# EAGLE board H17R10 (EAGLE 9.6.2)
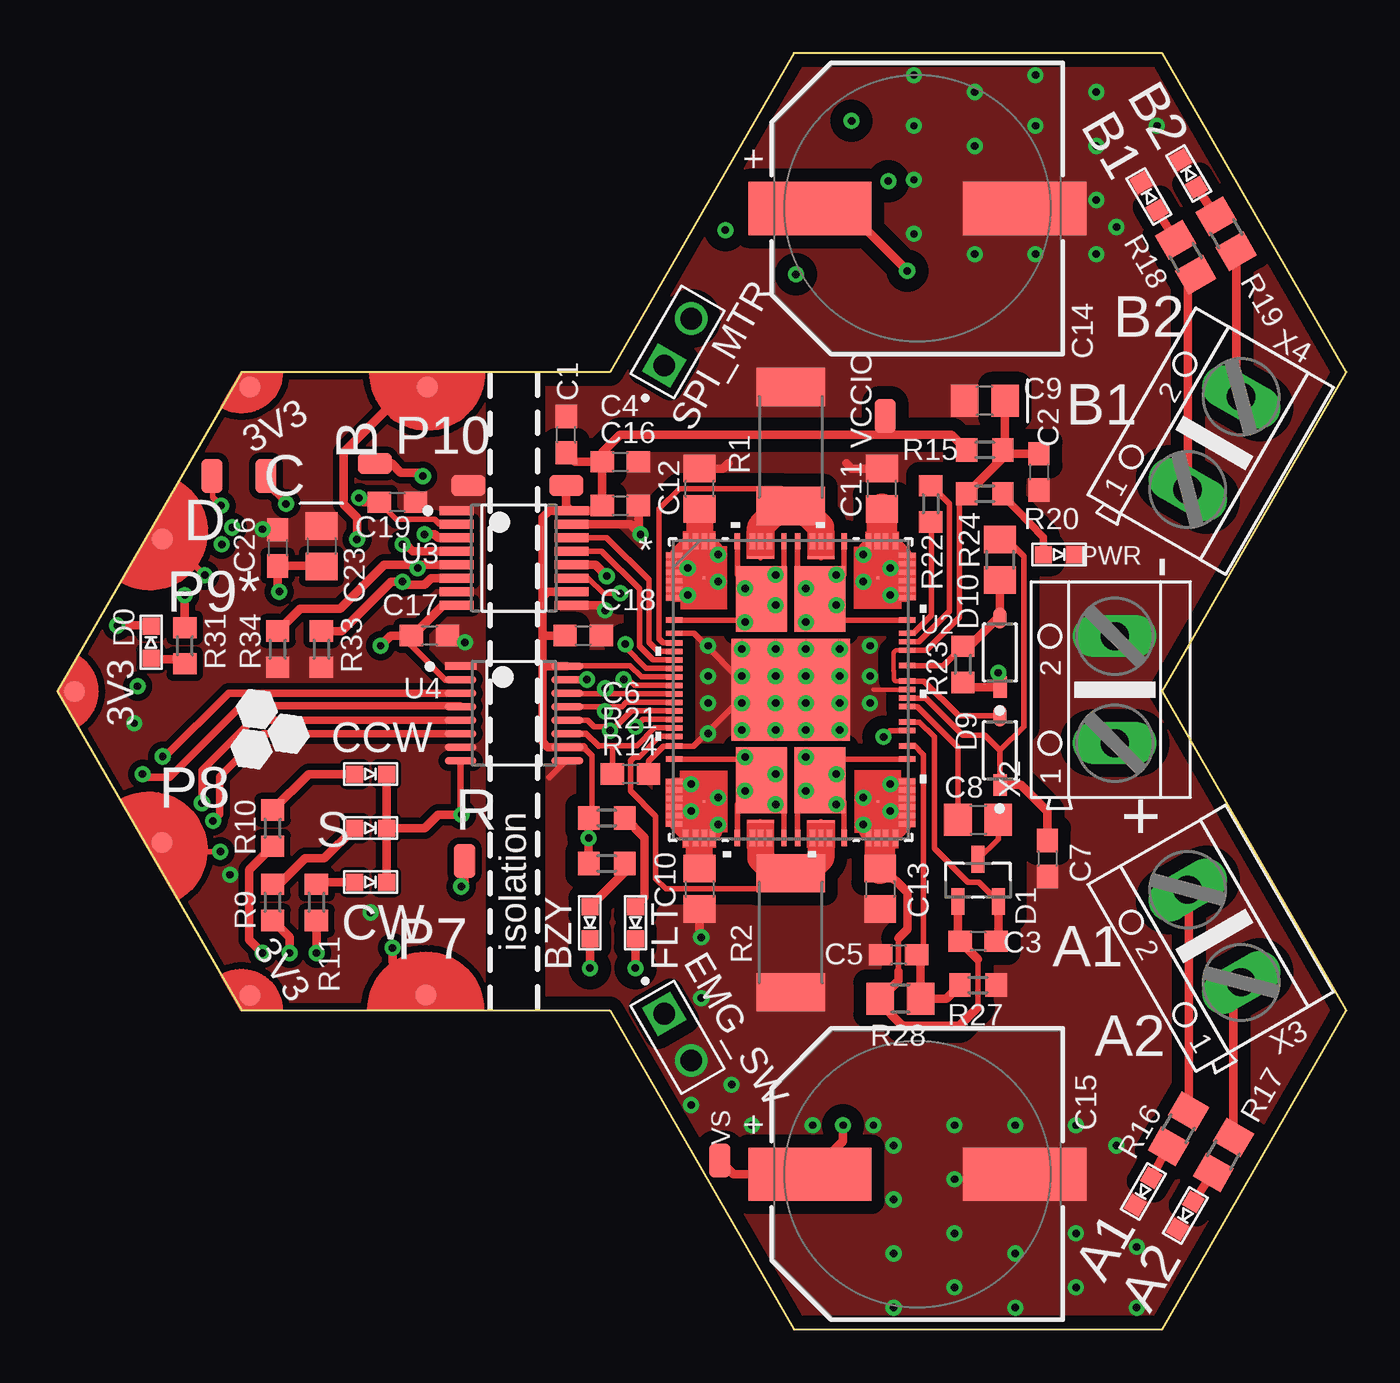
[diagram p4: board, top side]
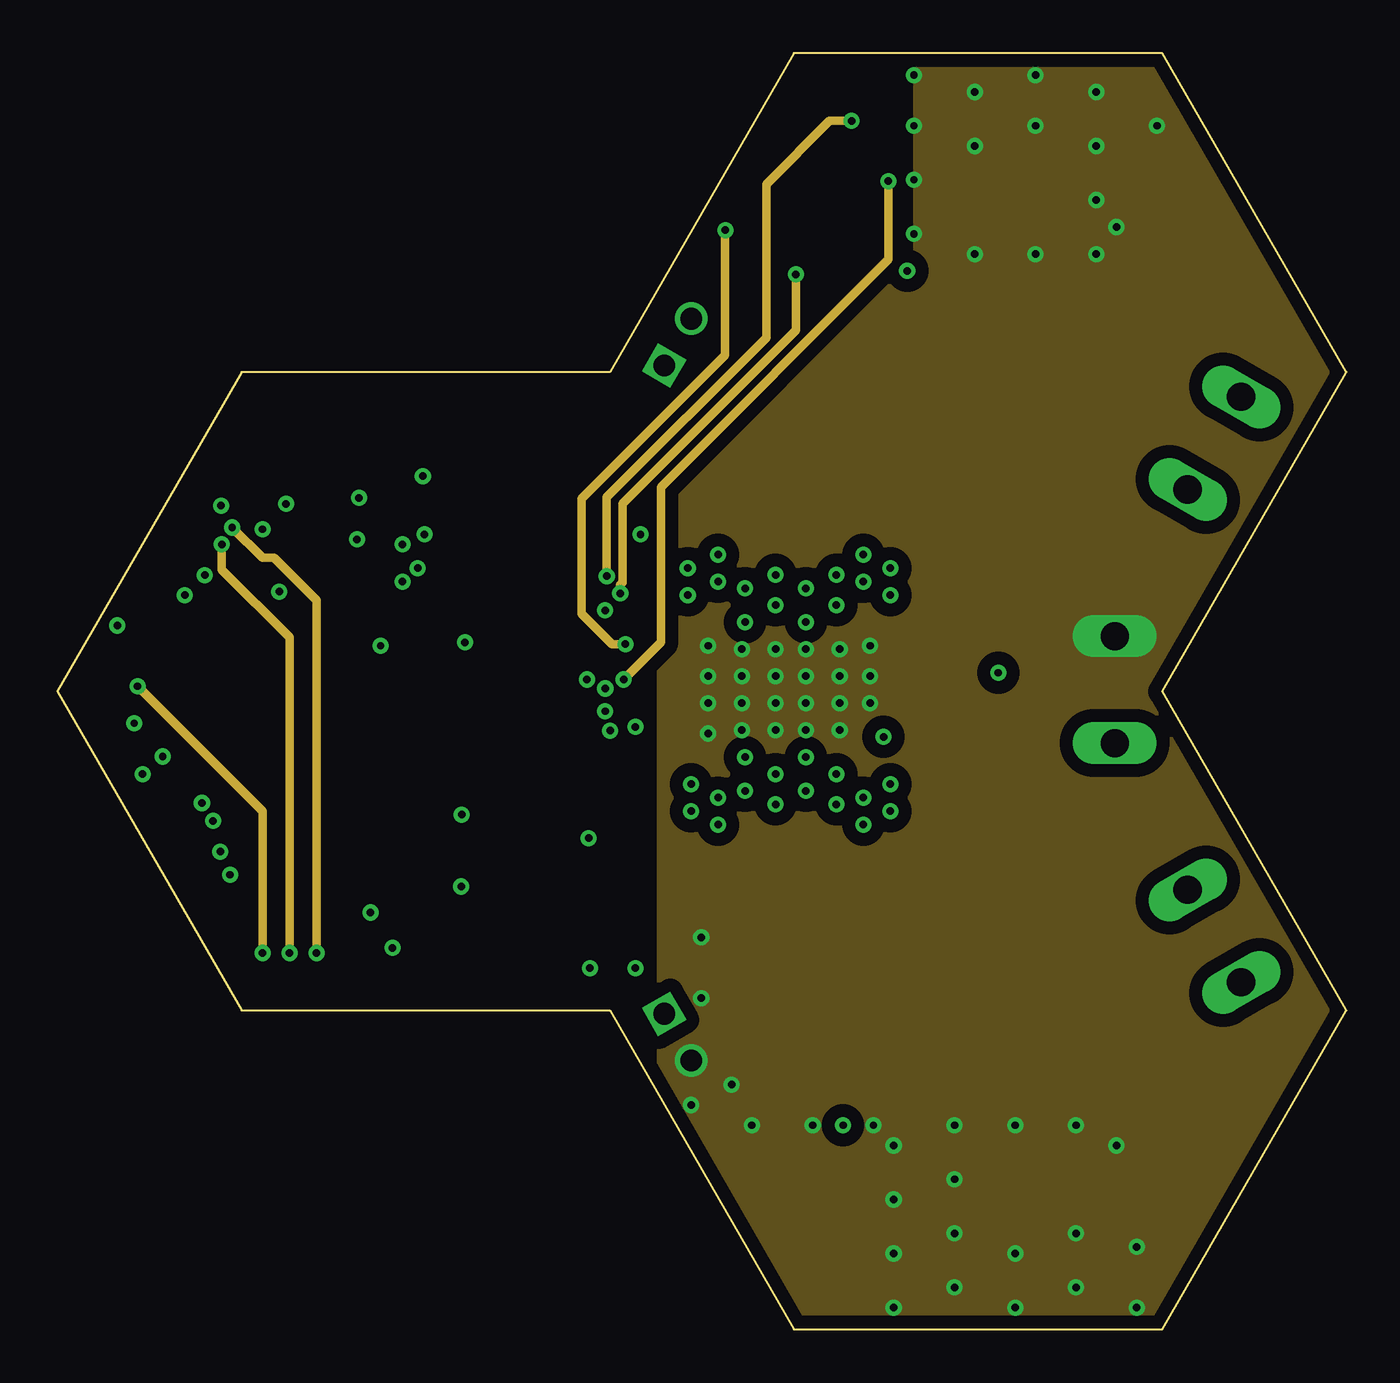
[diagram p5: board, inner layer Route2]
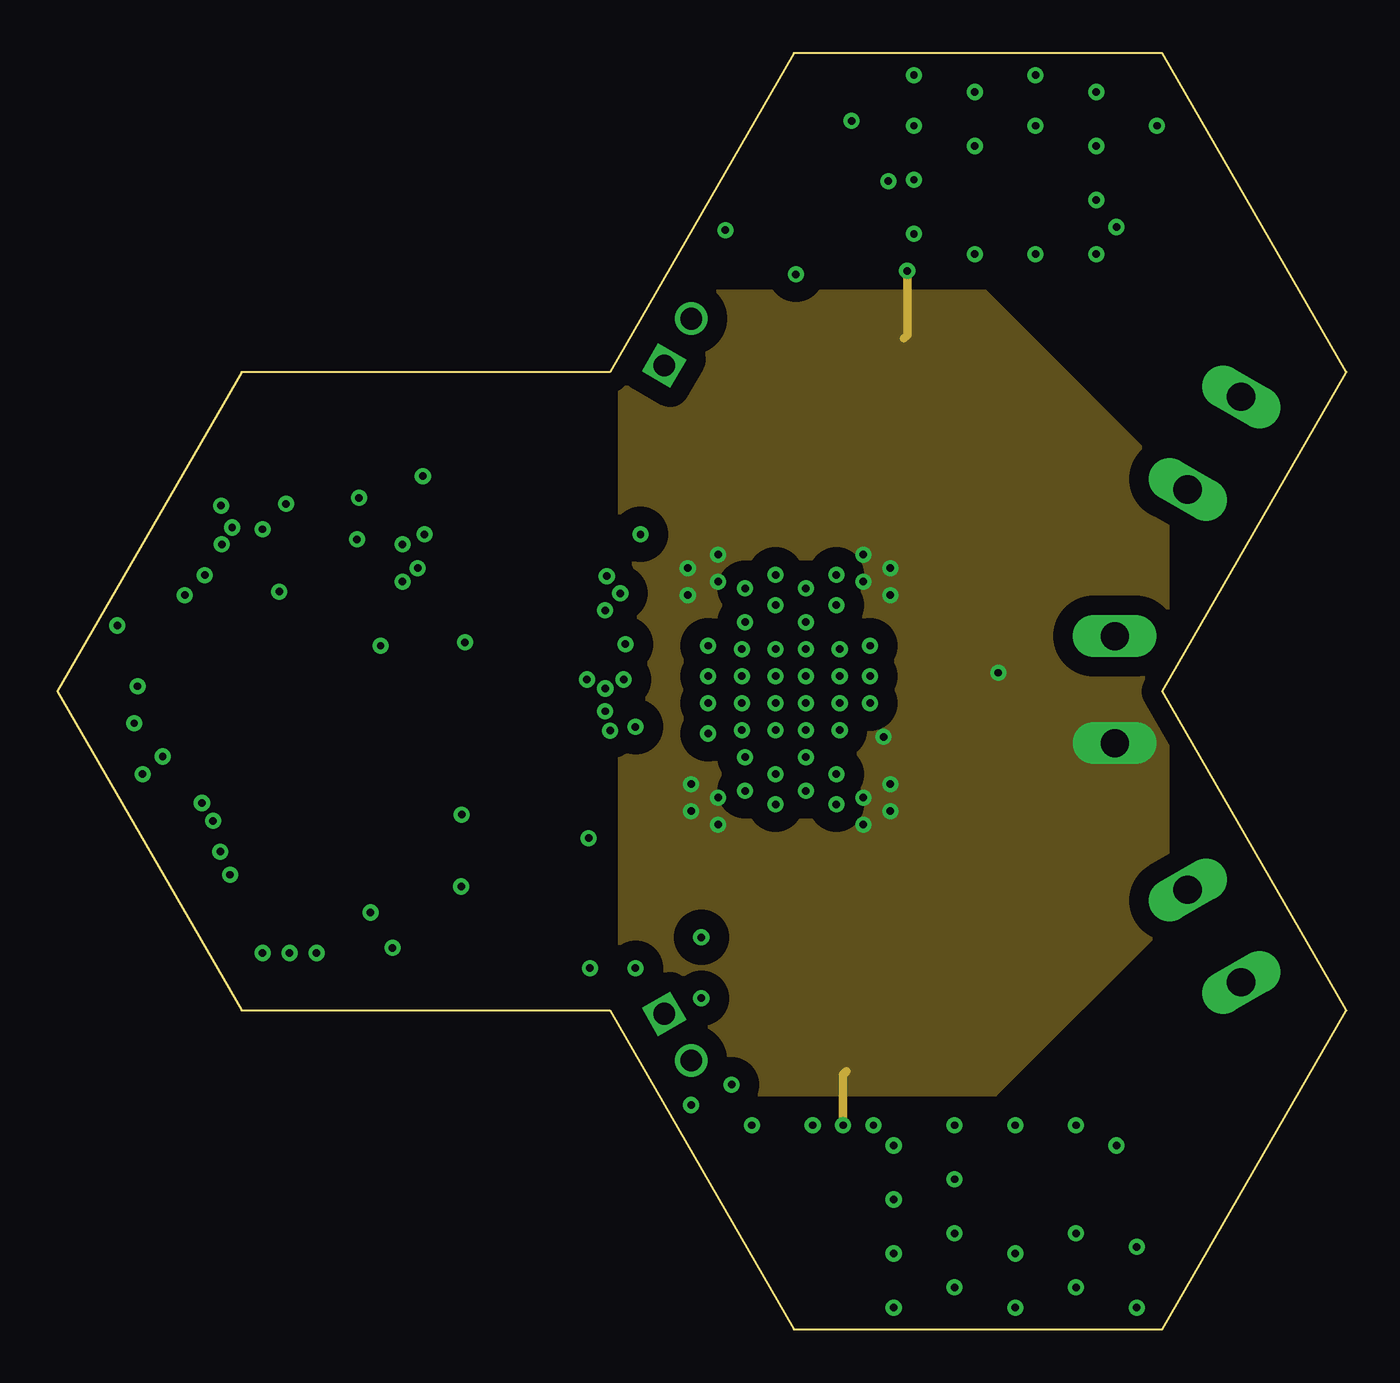
[diagram p6: board, inner layer Route3]
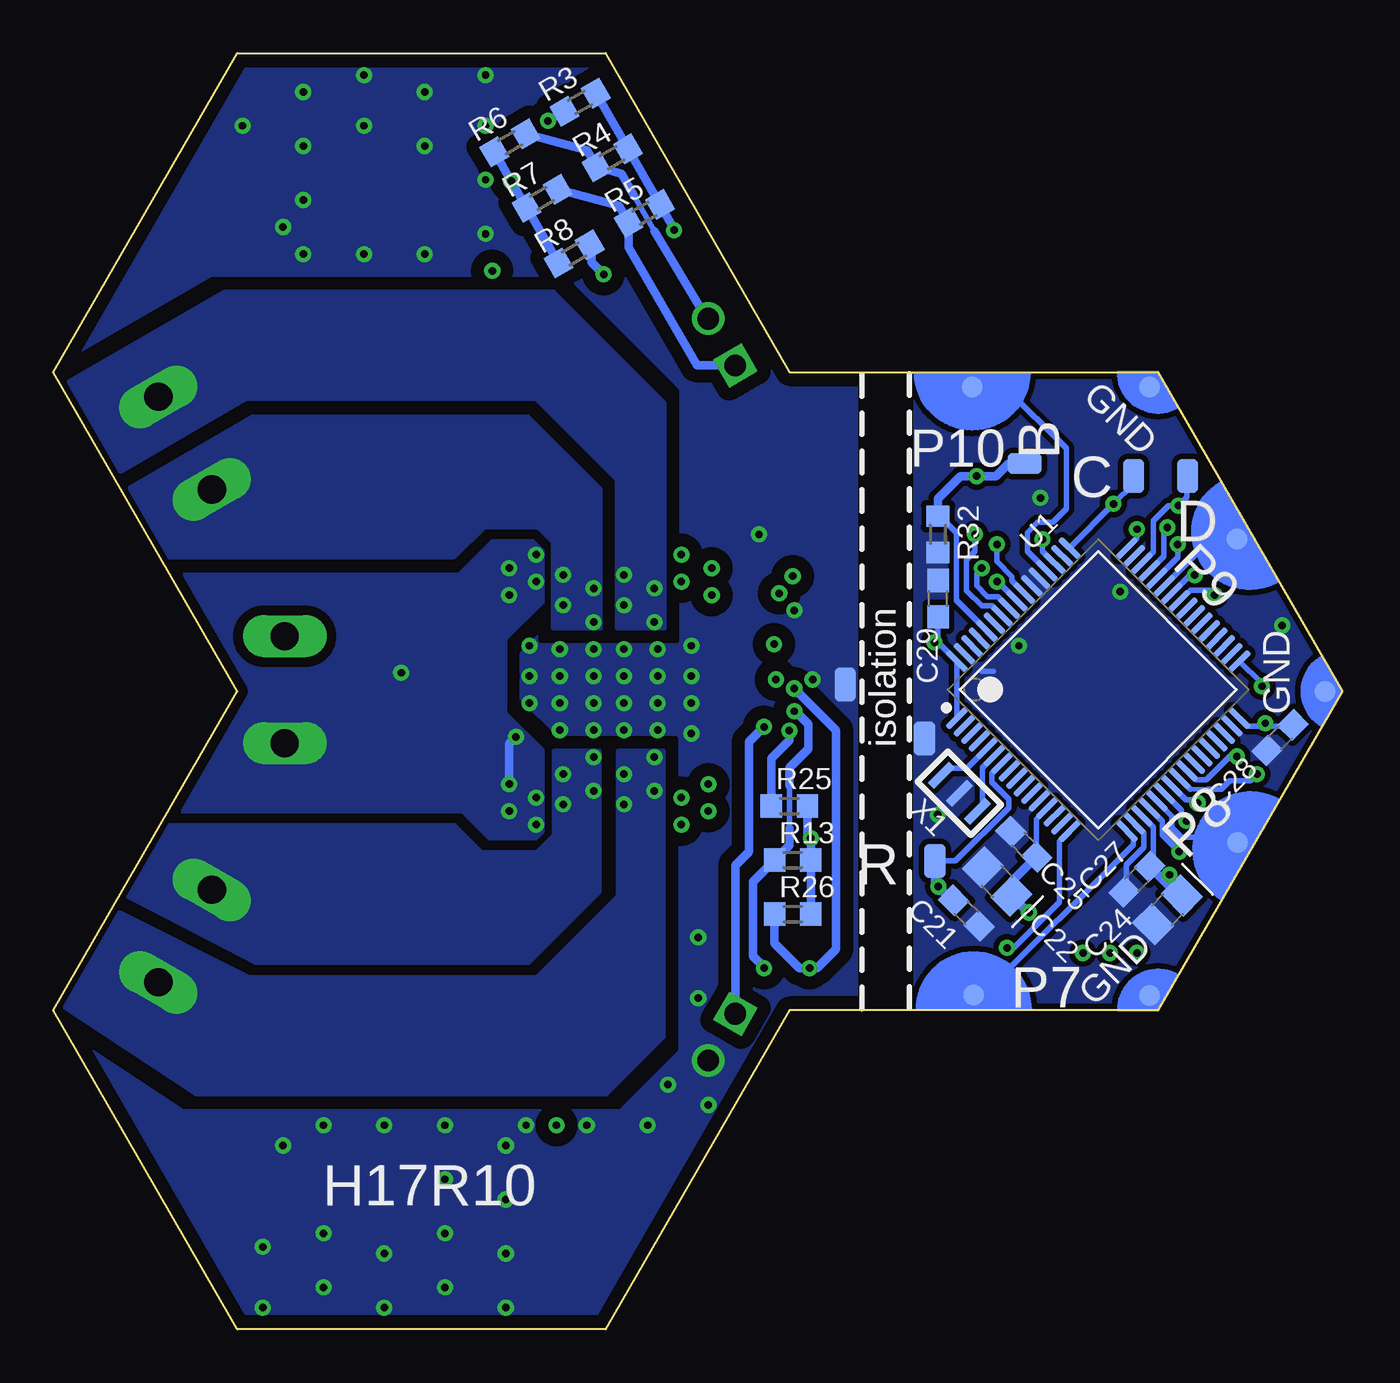
[diagram p7: board, bottom side, seen from below]

Size 60.62 x 60 mm. Coordinates in mm from the lower left corner, seen from the top.
Copper layers (1*2+15*16): Top 0.035mm / dielectric 0.175mm / Route2 0.035mm / dielectric 1.11mm / Route15 0.035mm / dielectric 0.175mm / Bottom 0.035mm
Design rules "2_layer *": minimum track width 7mil, minimum drill 10mil, track to track 6mil, track to pad 6mil, pad to pad 6mil, via to via 6mil, smd to smd 0mil, copper to edge 1mil, drill to drill 8mil, minimum pad ring 10mil, minimum via ring 8mil, stop-mask expansion 2mil, vias tented up to drill 15mil, thermal gap 10mil

## Footprints (pad centres in the part's own frame; a part is rotated, then mirrored left to right if it is on the bottom)
VLMY1300-GS08 = smd 0.8 x 0.8: A 0,0.75; C 0,-0.75
PAD1 = smd 1.6 x 1: P$1 0,0 | smd 1.6 x 1 bottom: P$2 0,0
C-0603 = smd 1.1 x 1: 1 -0.85,0; 2 0.85,0
C-0805 = smd 1.3 x 1.5: 1 -0.95,0; 2 0.95,0
C-0805-POL = smd 1.3 x 1.5: 1 -0.95,0; 2 0.95,0
WCAP-ASLI_12.5X14(DXL) = smd 5.8 x 2.5: 1 5.05,0; 2 -5.05,0
VLMTG1300-GS08 = smd 0.8 x 0.8: A 0,0.75; C 0,-0.75
VLMS1300-GS08 = smd 0.8 x 0.8: A 0,0.75; C 0,-0.75
STMICROELECTRONICS_BAR43SFILM_0 = smd 1.26 x 0.61: 1 -0.995,0.95; 2 -0.995,-0.95; 3 0.995,0
STMICROELECTRONICS_BAT46ZFILM_3 = smd 1.006 x 0.641: 1 -1.625,0; 2 1.625,0
TE_3-644456-2 = drill 1.02 pad 1.37 square: 1 0,0 | drill 1.02 pad 1.37: 2 2.54,0
HEXABIT_17.32_X3_NO_P1_P2_P3_P4_P5_P6_P11_P12 = smd 1 x 1 bottom: PAD_PD1 -21.88,-6.86; PAD_PD2 -21.84,7.39; PAD_PD12 -25.99,0.24 | smd 1 x 1 rotated 240 bottom: PAD_PD3 -9.468,-14.037; PAD_PD8 -9.394,14.542 | smd 1 x 1 rotated 60 bottom: PAD_PD17 -17.741,-14.056 | smd 1 x 1 rotated 300 bottom: PAD_PD19 -17.727,14.55 | smd 1 x 1: PAD_PU1 -21.88,-6.86; PAD_PU2 -21.84,7.39; PAD_PU12 -25.99,0.24 | smd 1 x 1 rotated 240: PAD_PU3 -9.468,-14.037; PAD_PU8 -9.394,14.542 | smd 1 x 1 rotated 60: PAD_PU17 -17.741,-14.056 | smd 1 x 1 rotated 300: PAD_PU19 -17.727,14.55
PAD4 = smd 1.6 x 1: P$1 0,0
R2512 = smd 1.8 x 3.2: 1 -2.8,0; 2 2.8,0
R-0603 = smd 1 x 1.1: 1 -0.85,0; 2 0.85,0
R-0805 = smd 1.3 x 1.5: 1 -0.95,0; 2 0.95,0
STMICROELECTRONICS_STM32F091RBT6_1 = smd 1.3 x 0.3: 1 -5.65,3.75; 2 -5.65,3.25; 3 -5.65,2.75; 4 -5.65,2.25; 5 -5.65,1.75; 6 -5.65,1.25; 7 -5.65,0.75; 8 -5.65,0.25; 9 -5.65,-0.25; 10 -5.65,-0.75; 11 -5.65,-1.25; 12 -5.65,-1.75; 13 -5.65,-2.25; 14 -5.65,-2.75; 15 -5.65,-3.25; 16 -5.65,-3.75; 33 5.65,-3.75; 34 5.65,-3.25; 35 5.65,-2.75; 36 5.65,-2.25; 37 5.65,-1.75; 38 5.65,-1.25; 39 5.65,-0.75; 40 5.65,-0.25; 41 5.65,0.25; 42 5.65,0.75; 43 5.65,1.25; 44 5.65,1.75; 45 5.65,2.25; 46 5.65,2.75; 47 5.65,3.25; 48 5.65,3.75 | smd 0.3 x 1.3: 17 -3.75,-5.65; 18 -3.25,-5.65; 19 -2.75,-5.65; 20 -2.25,-5.65; 21 -1.75,-5.65; 22 -1.25,-5.65; 23 -0.75,-5.65; 24 -0.25,-5.65; 25 0.25,-5.65; 26 0.75,-5.65; 27 1.25,-5.65; 28 1.75,-5.65; 29 2.25,-5.65; 30 2.75,-5.65; 31 3.25,-5.65; 32 3.75,-5.65; 49 3.75,5.65; 50 3.25,5.65; 51 2.75,5.65; 52 2.25,5.65; 53 1.75,5.65; 54 1.25,5.65; 55 0.75,5.65; 56 0.25,5.65; 57 -0.25,5.65; 58 -0.75,5.65; 59 -1.25,5.65; 60 -1.75,5.65; 61 -2.25,5.65; 62 -2.75,5.65; 63 -3.25,5.65; 64 -3.75,5.65
VFQFPN89_11X14X1_STM = smd 0.762 x 0.254: 1 -5.475,6.32; 2 -5.475,5.92; 3 -5.475,5.52; 4 -5.475,5.12; 5 -5.475,4.72; 6 -5.475,4.32; 7 -5.475,3.27; 8 -5.475,2.65; 9 -5.475,2.2; 10 -5.475,1.8; 11 -5.475,1.4; 12 -5.475,1; 13 -5.475,0.6; 14 -5.475,0.2; 15 -5.475,-0.2; 16 -5.475,-0.6; 17 -5.475,-1; 18 -5.475,-1.4; 19 -5.475,-1.8; 20 -5.475,-2.2; 21 -5.475,-2.65; 22 -5.475,-3.27; 23 -5.475,-4.32; 24 -5.475,-4.72; 25 -5.475,-5.12; 26 -5.475,-5.52; 27 -5.475,-5.92; 28 -5.475,-6.32; 47 5.475,-6.32; 48 5.475,-5.92; 49 5.475,-5.52; 50 5.475,-5.12; 51 5.475,-4.72; 52 5.475,-4.32; 53 5.475,-3.27; 54 5.475,-2.65; 55 5.475,-1.93; 56 5.475,-1.53; 57 5.475,-0.8; 58 5.475,-0.4; 59 5.475,0; 60 5.475,0.4; 61 5.475,1.13; 62 5.475,1.85; 63 5.475,2.25; 64 5.475,2.65; 65 5.475,3.27; 66 5.475,4.32; 67 5.475,4.72; 68 5.475,5.12; 69 5.475,5.52; 70 5.475,5.92; 71 5.475,6.32 | smd 0.254 x 0.762: 29 -4.93,-6.975; 30 -4.46,-6.975; 31 -4.06,-6.975; 32 -3.66,-6.975; 33 -2.51,-6.975; 34 -1.82,-6.975; 35 -1.42,-6.975; 36 -1.01,-6.975; 37 -0.32,-6.975; 38 0.32,-6.975; 39 1.01,-6.975; 40 1.42,-6.975; 41 1.82,-6.975; 42 2.51,-6.975; 43 3.66,-6.975; 44 4.06,-6.975; 45 4.46,-6.975; 46 4.93,-6.975; 72 4.93,6.975; 73 4.46,6.975; 74 4.06,6.975; 75 3.66,6.975; 76 2.51,6.975; 77 1.82,6.975; 78 1.42,6.975; 79 1.01,6.975; 80 0.32,6.975; 81 -0.32,6.975; 82 -1.01,6.975; 83 -1.42,6.975; 84 -1.82,6.975; 85 -2.51,6.975; 86 -3.66,6.975; 87 -4.06,6.975; 88 -4.46,6.975; 89 -4.93,6.975 | smd 0.127 x 0.127: EPAD1 -4.085,5.26; EPAD2 -4.085,-5.26; EPAD5 4.085,-5.26; EPAD6 4.085,5.26 | smd 2.388 x 3.099: EPAD3 -1.38,-4.26; EPAD4 1.38,-4.26; EPAD7 1.38,4.26; EPAD8 -1.38,4.26 | smd 5.588 x 4.801: EPAD9 0,0 | smd 1.27 x 0.127: EPAD10 -1.42,-6.206; EPAD11 1.42,-6.206; EPAD12 1.42,6.206; EPAD13 -1.42,6.206
TEXAS_INSTRUMENTS_ISO7741DBQR_0 = smd 1.6 x 0.41: 1 -2.7,2.222; 2 -2.7,1.587; 3 -2.7,0.952; 4 -2.7,0.318; 5 -2.7,-0.318; 6 -2.7,-0.952; 7 -2.7,-1.587; 8 -2.7,-2.222; 9 2.7,-2.222; 10 2.7,-1.587; 11 2.7,-0.952; 12 2.7,-0.318; 13 2.7,0.318; 14 2.7,0.952; 15 2.7,1.587; 16 2.7,2.222
TEXAS_INSTRUMENTS_ISO7742DBQR_3 = smd 1.48 x 0.344: 1 -2.508,2.222; 2 -2.508,1.587; 3 -2.508,0.952; 4 -2.508,0.317; 5 -2.508,-0.318; 6 -2.508,-0.953; 7 -2.508,-1.588; 8 -2.508,-2.223; 9 2.508,-2.223; 10 2.508,-1.588; 11 2.508,-0.953; 12 2.508,-0.318; 13 2.508,0.317; 14 2.508,0.952; 15 2.508,1.587; 16 2.508,2.222
XTALL_CSTCE8M00G52 = smd 1.4 x 0.4: P$1 0,1.2; P$2 0,0; P$3 0,-1.2
AK500/2 = drill 1.321 long: 1 -2.515,0; 2 2.515,0

## Placement (x,y rotation side)
A1  YELLOW  [VLMY1300-GS08]  51.07,6.48 330 top
A2  YELLOW  [VLMY1300-GS08]  53.05,5.35 330 top
B  PAD1  [PAD1]  14.93,40.71 180 top
B1  YELLOW  [VLMY1300-GS08]  51.34,53.27 210 top
B2  YELLOW  [VLMY1300-GS08]  53.2,54.34 210 top
BZY  YELLOW  [VLMY1300-GS08]  25.04,19.12 0 top
C  PAD1  [PAD1]  9.8,40.11 270 top
C1  100nF  [C-0603]  23.93,42.06 90 top
C2  220nF  [C-0603]  46.16,40.32 270 top
C3  470nF  [C-0603]  43.3,18.25 180 top
C4  3.3nF  [C-0603]  26.47,40.79 0 top
C5  DNP  [C-0603]  39.57,17.62 180 top
C6  100nF  [C-0603]  26.95,26.11 0 top
C7  470nF  [C-0603]  46.55,22.14 270 top
C8  47nF  [C-0805]  43.3,23.97 0 top
C9  22uF  [C-0805-POL]  43.62,43.65 180 top
C10  220nF  [C-0805]  30.2,20.71 270 top
C11  220nF  [C-0805]  38.78,39.52 90 top
C12  220nF  [C-0805]  30.2,39.52 90 top
C13  220nF  [C-0805]  38.7,20.71 270 top
C14  68uF  [WCAP-ASLI_12.5X14(DXL)]  40.44,52.7 180 top
C15  68uF  [WCAP-ASLI_12.5X14(DXL)]  40.44,7.3 180 top
C16  100nF  [C-0603]  26.47,38.73 0 top
C17  100nF  [C-0603]  17.5,32.62 180 top
C18  100nF  [C-0603]  24.73,32.62 0 top
C19  100nF  [C-0603]  15.99,38.89 180 top
C21  100nF  [C-0603]  17.66,19.57 315 bottom
C22  1.00uF  [C-0805-POL]  16.22,21.06 135 bottom
C23  4.7uF  [C-0805-POL]  12.42,36.82 270 top
C24  4.7uF  [C-0805-POL]  8.22,19.73 225 bottom
C25  10nF  [C-0603]  14.98,22.81 135 bottom
C26  100nF  [C-0603]  10.36,36.75 270 top
C27  100nF  [C-0603]  9.65,21.16 225 bottom
C28  100nF  [C-0603]  2.92,27.82 225 bottom
C29  100nF  [C-0603]  19,34.36 90 bottom
CCW  Green  [VLMTG1300-GS08]  14.73,26.11 90 top
CW  Green  [VLMTG1300-GS08]  14.73,21.03 90 top
D  PAD1  [PAD1]  7.26,40.11 90 top
D0  RED  [VLMS1300-GS08]  4.41,32.3 180 top
D1  STMICROELECTRONICS_BAR43SFILMSTMICROELECTRONICS_BAR43SFILM_0_0  [STMICROELECTRONICS_BAR43SFILM_0]  43.3,21.11 90 top
D9  STMICROELECTRONICS_BAT46ZFILMSTMICROELECTRONICS_BAT46ZFILM_0_3  [STMICROELECTRONICS_BAT46ZFILM_3]  44.33,27.22 90 top
D10  STMICROELECTRONICS_BAT46ZFILMSTMICROELECTRONICS_BAT46ZFILM_0_3  [STMICROELECTRONICS_BAT46ZFILM_3]  44.33,31.82 90 top
EMG_SW  3-644456-2  [TE_3-644456-2]  28.54,14.84 300 top
FLT  RED  [VLMS1300-GS08]  27.19,19.12 0 top
P1  HEXABIT__X3_NO_P1_P2_P3_P4_P5_P6_P11_P12  [HEXABIT_17.32_X3_NO_P1_P2_P3_P4_P5_P6_P11_P12]  26.79,29.76 0 top
P3  PAD4  [PAD4]  3.06,-13.26 0 top  (outside the outline)
P4  PAD4  [PAD4]  19.33,39.68 0 top
P5  PAD4  [PAD4]  19.65,27.78 270 bottom
P6  PAD4  [PAD4]  23.38,30.32 270 bottom
PWR  Green  [VLMTG1300-GS08]  47.11,36.43 90 top
R  PAD1  [PAD1]  19.15,22.02 90 top
R1  0R1  [R2512]  34.49,41.51 270 top
R2  0R1  [R2512]  34.49,18.65 90 top
R3  0R  [R-0603]  35.83,57.69 30 bottom
R4  DNP  [R-0603]  34.33,55.08 30 bottom
R5  DNP  [R-0603]  32.82,52.46 30 bottom
R6  DNP  [R-0603]  39.13,55.78 210 bottom
R7  DNP  [R-0603]  37.63,53.17 210 bottom
R8  0R  [R-0603]  36.12,50.56 210 bottom
R9  270.0R  [R-0603]  10.12,20.08 270 top
R10  270.0R  [R-0603]  10.12,23.57 270 top
R11  270.0R  [R-0603]  12.18,20.08 270 top
R13  39K  [R-0603]  25.84,22.06 0 bottom
R14  330  [R-0603]  25.84,21.9 180 top
R15  0R  [R-0603]  43.62,41.35 0 top
R16  10k  [R-0805]  52.73,9.43 60 top
R17  10k  [R-0805]  54.84,8.2 60 top
R18  10k  [R-0805]  53.06,50.4 300 top
R19  10k  [R-0805]  54.97,51.51 300 top
R20  330  [R-0603]  43.62,39.28 180 top
R21  330  [R-0603]  25.84,24.05 180 top
R22  DNP  [R-0603]  41.08,38.81 270 top
R23  0R  [R-0603]  42.59,31.27 90 top
R24  DNP  [R-0805]  44.33,36.19 270 top
R25  39K  [R-0603]  26,24.6 0 bottom
R26  39K  [R-0603]  25.84,19.52 0 bottom
R27  DNP  [R-0603]  43.3,16.19 180 top
R28  DNP  [R-0805]  39.65,15.55 180 top
R31  270.0R  [R-0603]  5.99,32.14 90 top
R32  10.0K  [R-0603]  19.01,37.38 90 bottom
R33  DNP  [R-0603]  12.42,31.98 270 top
R34  DNP  [R-0603]  10.36,31.98 270 top
S  RED  [VLMS1300-GS08]  14.73,23.57 90 top
SPI_MTR  3-644456-2  [TE_3-644456-2]  28.54,45.32 60 top
U1  STM32F091RBT6STMICROELECTRONICS_STM32F091RBT6_0_1  [STMICROELECTRONICS_STM32F091RBT6_1]  11.47,30.08 45 bottom
U2  [VFQFPN89_11X14X1_STM]  34.49,30.08 0 top
U3  TEXAS_INSTRUMENTS_ISO7741DBQRTEXAS_INSTRUMENTS_ISO7741DBQR_0_0  [TEXAS_INSTRUMENTS_ISO7741DBQR_0]  21.47,36.27 0 top
U4  TEXAS_INSTRUMENTS_ISO7742DBQRTEXAS_INSTRUMENTS_ISO7742DBQR_0_3  [TEXAS_INSTRUMENTS_ISO7742DBQR_3]  21.47,28.97 0 top
VCCIO  PAD4  [PAD4]  38.93,42.94 90 top
VCCIO1  PAD4  [PAD4]  23.93,39.68 0 top
VS  PAD4  [PAD4]  31.16,7.93 270 top
X1  XTALL_CSTCE8M00G52  [XTALL_CSTCE8M00G52]  18,25.21 45 bottom
X2  [AK500/2]  49.73,30.08 90 top
X3  [AK500/2]  54.41,18.49 120 top
X4  [AK500/2]  54.41,41.67 60 top

## Tracks (layer width: path | path; a pad name or v marks a point on that pad's centre or on a via)
ADC_IN
  Top 0.254: U2.54 39.99,27.45 40.3,27.45 40.74,27.01 40.74,17.94 C5.1
  Top 0.406: R27.2 41.82,15.55 R28.1 40.6,17.44 C5.1
B1  (via drill 0.35)
  Top 0.406: v17.19,40.11 17.03,40.27 16.15,40.27 15.71,40.71 B.P$1
  Bottom 0.254: R32.2 18.91,38.23 18.14,37.46 18.14,34.27 U1.60
  Bottom 0.406: R32.2 19.01,39.05 17.94,40.11 v17.19,40.11 16.28,40.11 15.68,40.71 B.P$1
BUSY/SYNC  (via drill 0.35)
  Top 0.254: U2.15 25.84,29.88 | 25.84,29.88 23.98,29.88 U4.14 | 25.84,29.88 25.77,29.95 v25.77,30.13
  Top 0.406: BZY.C v25.04,16.98
  Bottom 0.406: R26.1 26.69,18.15 25.52,16.98 v25.04,16.98 24.7,16.98 23.81,17.87 23.81,28.18 v25.77,30.13
CK
  Top 0.254: U2.11 28.01,31.48 27.37,32.11 27.37,34.81 25.6,36.59 U3.13
CP
  Top 0.254: U2.57 40.45,29.28 42.35,27.38 C8.1
CS
  Top 0.254: U2.10 28.24,31.88 27.82,32.3 27.82,35.24 25.84,37.22 U3.14
FLAG  (via drill 0.35)
  Top 0.254: U4.13 25.68,29.28 | 25.68,29.28 26.55,29.28 26.75,29.48 U2.16 | 25.68,29.28 25.76,29.2 v25.76,29.06
  Top 0.406: FLT.C v27.19,16.98
  Bottom 0.254: 26,25.55 26,23.57
  Bottom 0.406: v27.19,16.98 27.19,17.04 27.7,17.55 27.7,21.05 R13.1 26,22.75 26,23.57 | v25.76,29.06 25.71,29.06 25.1,28.46 25.1,27.29 26,26.4 26,25.55
FORWARD  (via drill 0.35)
  Top 0.406: v9.65,17.69 9.01,18.33 9.01,21.61 R10.2
  Route2 0.406: v9.65,17.69 9.65,24.36 v3.77,30.24
  Bottom 0.254: U1.33 3.77,30.37 v3.77,30.24
GND  (via drill 0.35)
  Top 0.254: U4.2 18.24,30.55 | C19.2 15.94,38.09 17.74,38.09 17.98,37.86 U3.2
  Top 0.305: 18.24,30.55 16.65,32.14 C17.2 | U4.8 18.96,24.25 v19.01,24.2
  Top 0.406: C23.2 12.4,35.89 C26.2 10.36,34.76 v10.44,34.68 | 2.86,33.05 v2.82,33.09 4.36,33.09 D0.C | v15.2,32.14 15.68,32.62 C17.2 16.71,32.62 18.14,34.05 U3.8 | C19.2 14.39,38.89 v14.19,39.09 | CW.C S.C | S.C CCW.C | S.C 17.27,23.57 17.9,24.2 v19.01,24.2
  Bottom 0.254: 16.94,30.95 16.39,30.95 | U1.18 9.33,23.34 9.33,22.66 10.15,21.84 10.15,20.66 C27.2
  pour Bottom (isolate 0.254, no thermals): 20.12,45.08 8.53,45.08 -0.04,30.43 -0.04,30 8.53,15.08 20.12,15.08
GND1  (via drill 0.35)
  Top 0.203: U2.59 38.38,30.08
  Top 0.254: U2.8 29.93,32.73 32.58,30.08 U2.EPAD9 32.56,30.08 29.91,27.43 U2.21 28.51,27.43 27.8,26.72 C6.2 | U4.15 | v24.9,30.55 U4.15
  Top 0.305: U4.9 23.93,26.74 23.14,25.95
  Top 0.406: v25.76,33.81 25.52,34.05 U3.9 | U3.15 26.95,37.85 v27.43,37.38 27.32,37.48 C16.2 | C11.2 37.35,40.47 37.11,40.71 | C12.2 31.31,40.47 31.55,40.71 | C10.2 30.2,18.51 v30.28,18.43
  other vias: 30.6,32.14 38.22,32.14 36.79,31.98 35.2,31.98 33.77,31.98 32.19,31.98 32.19,30.71 33.77,30.71 35.2,30.71 36.79,30.71 32.19,28.17 33.77,28.17 35.2,28.17 36.79,28.17 36.79,29.44 35.2,29.44 33.77,29.44 32.19,29.44 38.22,30.71 38.22,29.44 30.6,30.71 30.6,29.44 30.6,28.01 39.33,1.03 29.81,10.55 39.33,3.57 39.33,6.11 39.33,8.65 31.71,11.5 35.52,9.6 32.66,9.6 38.38,9.6 30.28,15.57 42.19,1.98 50.76,1.03 42.19,4.52 42.19,7.06 42.19,9.6 50.76,3.88 47.9,1.98 49.81,8.65 47.9,4.52 47.9,9.6 45.05,1.03 45.05,3.57 40.28,51.51 40.28,54.05 40.28,56.59 40.28,58.97 43.14,50.56 43.14,55.64 43.14,58.18 46,56.59 46,58.97 48.86,50.56 48.86,53.1 48.86,55.64 48.86,58.18 45.05,9.6 46,50.56 51.71,56.59 49.81,51.83
  pour Bottom (isolate 0.61, rank 2, no thermals): 22.82,44.67 22.82,15.21 31.66,-0.01 52.03,-0.01 60.76,15.08 52.19,30 52.19,30.16 60.76,45.08 52.03,60.16 31.7,60.16
  pour Top (isolate 0.61, no thermals): 22.98,44.95 22.98,14.94 31.66,-0.01 52.03,-0.01 60.76,15.08 52.19,30 52.19,30.16 60.76,45.08 52.03,60.16 31.7,60.16
  pour Route2 (isolate 0.61, no thermals): 34.65,-0.01 28.3,10.87 28.3,38.25 31.16,41.11 40.36,50.4 40.36,60 51.95,60 60.6,45 51.95,30 60.6,15 51.95,-0.01
MC_BUSY/SYNC  (via drill 0.35)
  Top 0.356: U4.3 8.06,29.92 5.07,26.94 v4.95,26.94
  Bottom 0.254: U1.25 7.28,26.26 6.85,25.83 6.38,25.83 5.27,26.94 v4.95,26.94
MC_CK  (via drill 0.35)
  Top 0.406: U3.4 16.71,36.59 16.39,36.9 v16.23,36.9
  Bottom 0.254: U1.55 15.52,35.19 15.52,35.4 16.23,36.11 v16.23,36.9
MC_CS  (via drill 0.35)
  Top 0.406: U3.3 17.9,37.22 17.74,37.38 v17.27,37.38
  Bottom 0.254: v17.27,37.38 17.27,36.59 17.66,36.19 17.66,34.73 16.95,34.02 16.47,34.02 U1.58
MC_FLAG  (via drill 0.35)
  Top 0.356: v4.01,26.11 4.17,25.95 5.28,25.95 8.64,29.32 18.93,29.32 U4.4
  Bottom 0.203: 7.14,25.39 6.31,25.39
  Bottom 0.254: U1.24 7.14,25.39 | 6.31,25.39 5.68,25.39 5.28,25.79 4.33,25.79 v4.01,26.11
MC_MISO  (via drill 0.35)
  Top 0.406: U3.6 17.58,35.32 17.27,35 16.39,35 v16.23,35.16 15.7,35.16 13.38,32.83 R33.1
  Bottom 0.254: U1.56 16.2,35.16 v16.23,35.16
MC_MOSI  (via drill 0.35)
  Top 0.406: U3.5 17.11,35.95 | 17.11,35.95 v16.95,35.79 | R34.1 11.41,33.89 13.3,33.89 15.36,35.95 17.11,35.95
  Bottom 0.254: U1.57 16.2,34.45 16.67,34.45 17.19,34.96 17.19,35.55 v16.95,35.79
MC_STBY/RESET  (via drill 0.35)
  Top 0.356: U4.6 9.68,28.01 7.64,25.97 7.64,24.23 v7.32,23.91
  Bottom 0.254: U1.22 7.56,24.4 7.56,24.15 v7.32,23.91
MS_STCK  (via drill 0.35)
  Top 0.356: U4.5 9.17,28.65 6.8,26.28 v6.8,24.75
  Bottom 0.254: U1.23 7.36,24.91 6.96,24.91 v6.8,24.75
N$1
  Top 0.203: U2.62 39.44,31.93 39.33,31.82 39.33,30.98 39.33,30.97 39.33,30.55 39.41,30.48 U2.60
  Top 0.254: U2.60 40.76,30.48 42.39,28.85 D9.2 | U2.62 40.86,31.93 42.43,33.49 42.43,38.94 R20.2
  Top 0.406: R20.2 44.47,40.99 R15.2 | C2.1 44.65,41.17 R15.2 | C9.1 44.57,41.45 R15.2
N$2
  Top 0.254: C8.2 44.25,23.05 D1.3
N$3  (via drill 0.35)
  Top 0.406: R31.2 v5.99,34.52
  Bottom 0.254: U1.41 7.14,34.76 6.23,34.76 v5.99,34.52
N$4
  Top 0.406: R31.1 5.78,31.51 4.45,31.51 D0.A
N$5
  Bottom 0.254: U1.5 17.64,26.38 18.53,26.38 X1.P$1
N$6
  Bottom 0.254: U1.6 16.92,26.4 16.92,24.6 X1.P$3
N$7  (via drill 0.35)
  Top 0.254: D.P$1 7.3,39.13 v7.7,38.73
  Bottom 0.254: U1.46 8.89,36.55 8.89,38.02 8.17,38.73 v7.7,38.73 7.3,39.13 D.P$1
N$8
  Top 0.254: U2.58 40.84,29.68 42.58,27.93 43.62,27.93 44.33,27.22 | D9.1 44.33,27.22 | 44.33,27.22 45.44,28.33 45.44,36.35 44.65,37.14 R24.1
  Top 0.406: D9.1 45.32,25.6 46.55,24.36 46.55,23.89 C7.1
N$9  (via drill 0.35)
  Top 0.254: C.P$1 9.8,39.76 v10.76,38.81
  Bottom 0.254: U1.49 12.81,36.75 v10.76,38.81 9.8,39.76 C.P$1
N$10
  Top 0.406: A1.A R16.1
N$11
  Top 0.406: R9.1 10.44,20.93 11.65,22.14 12.55,22.14 S.A
N$12
  Top 0.406: BZY.A 26.69,21.52 R14.1
N$13
  Top 0.406: R21.1 27.62,23.11 27.62,20.31 FLT.A
N$14
  Top 0.356: R20.1 44.47,39.23 46.36,37.25 PWR.A
N$15
  Top 0.406: A2.A R17.1
N$16
  Top 0.406: B1.A R18.1
N$17
  Top 0.406: B2.A R19.1
N$18  (via drill 0.35)
  Top 0.406: U3.12 25.3,35.95 v25.84,35.41
  Route2 0.406: v25.84,35.41 25.84,39.13 33.34,46.63 33.34,53.84 36.31,56.82 v37.35,56.82
  Bottom 0.406: R3.1 v37.35,56.82
N$19  (via drill 0.35)
  Top 0.254: U3.11 24.96,35.32 25.68,34.6 v26.47,34.6
  Route2 0.406: v26.47,34.6 26.47,35.01 26.57,35.11 26.57,38.83 34.73,46.98 v34.73,49.6
  Bottom 0.406: R8.1 35.3,50.85 35.3,50.18 v34.73,49.6
N$20
  Bottom 0.254: 33.29,53.29 32.34,51.64
  Bottom 0.406: R6.1 35.52,55.44 R4.1 33.9,54.34 33.29,53.29 | 32.34,51.64 29.99,47.7 SPI_MTR.2
N$21
  Bottom 0.406: R7.1 34.01,52.82 R5.1 33.55,50.87 30.35,45.32 SPI_MTR.1
N$22
  Top 0.254: U2.64 39.99,32.75 40.28,32.75 41.1,33.57 41.1,37.94 R22.2
N$23
  Top 0.254: U2.63 40.53,32.33 41.95,33.75 41.95,38.81 41.1,39.66 R22.1
N$24
  Top 0.406: R10.1 11.81,26.11 CCW.A
N$25
  Top 0.406: R11.1 12.29,21.03 CW.A
OUTA1  (via drill 0.35)
  Top 0.178: U2.EPAD4 35.37,25.31
  Top 0.254: U2.42 37,24.79 35.97,25.82 U2.EPAD4 34.81,24.76 U2.38 | U2.53 36.86,26.81 35.92,25.87
  Top 0.406: R16.2 53.2,20.62 X3.2 | v36.63,26.11 36.16,26.11 35.92,25.87 U2.EPAD4 | 35.37,25.31 v35.2,25.31
  other vias: 36.63,24.68 35.2,26.9
  pour Bottom (isolate 0.254, no thermals): 34.89,27.22 37.11,27.22 37.11,23.25 37.9,22.46 40.44,22.46 41.71,23.73 55.49,23.73 57.41,20.47 51.1,17.22 38.22,17.22 34.89,20.55
OUTA2  (via drill 0.35)
  Top 0.254: U2.33 31.98,24.69 U2.EPAD3 | U2.37 34.17,24.76 U2.EPAD3 | U2.22 32.12,26.81 U2.EPAD3 | U2.EPAD3 33.48,25.82 v33.78,26.11
  Top 0.406: R17.2 55.31,15.95 X3.1
  other vias: 33.77,24.68 32.35,25.32 32.35,26.9
  pour Bottom (isolate 0.254, no thermals): 34.09,27.22 34.09,20.39 37.9,16.58 51.4,16.58 57.67,19.72 60.32,15.26 53.89,11.03 34.57,11.03 31.87,13.73 31.87,27.22
OUTB1  (via drill 0.35)
  Top 0.254: U2.65 36.86,33.35 U2.EPAD7 | U2.76 37,35.47 U2.EPAD7 | U2.80 34.81,35.4 U2.EPAD7
  Top 0.406: X4.1 53.16,49.19 R18.2 | U2.EPAD7 35.71,34.34 v35.2,34.84 | U2.EPAD7 35.87,34.71 v36.63,35.47 | U2.EPAD7 36.34,34.34 v36.63,34.05 | U2.EPAD7 35.2,33.67 v35.2,33.25
  pour Bottom (isolate 0.254, no thermals): 34.89,32.94 37.11,32.94 37.11,36.98 37.82,37.7 40.36,37.7 41.79,36.27 57.03,36.27 57.03,39.56 51.24,42.94 38.3,42.94 34.89,39.52
OUTB2  (via drill 0.35)
  Top 0.254: U2.7 32.12,33.35 U2.EPAD8 | U2.85 31.98,35.47 U2.EPAD8 | U2.81 34.17,35.4 U2.EPAD8
  Top 0.406: X4.2 55.44,44.07 R19.2 | U2.EPAD8 33.11,34.02 v32.35,33.25 | U2.EPAD8 33.11,34.81 v33.78,35.47 | U2.EPAD8 33.48,34.34 v33.78,34.05 | U2.EPAD8 32.85,34.34 v32.35,34.84
  pour Bottom (isolate 0.254, no thermals): 31.87,32.94 34.09,32.94 34.09,39.92 37.9,43.73 51.55,43.73 57.54,40.24 60,44.51 52.51,48.84 37.11,48.81 31.87,43.57
R1  (via drill 0.35)
  Top 0.406: R.P$1 19.15,20.98 v18.99,20.82
  Bottom 0.254: U1.7 16.47,26.14 16.47,25.71 15.68,24.92 15.68,24.52 18.18,22.02 R.P$1
  Bottom 0.406: C21.1 18.35,20.17 v18.99,20.82 19.15,20.98 R.P$1
REVERSED  (via drill 0.35)
  Top 0.406: R11.2 v12.19,17.69
  Route2 0.406: v8.22,37.7 9.65,36.27 10.2,36.27 12.19,34.29 v12.19,17.69
  Bottom 0.254: U1.45 8.39,36.34 8.39,37.53 v8.22,37.7
SDI  (via drill 0.35)
  Top 0.254: U2.12 27.7,31.08 26.71,32.06 v26.71,32.22
  Route2 0.406: v26.71,32.22 26.08,32.22 24.65,33.65 24.65,39.05 31.41,45.81 v31.41,51.67 v31.42,51.68
  Bottom 0.406: R3.2 R4.2 32.64,53.85 | 32.64,53.85 31.39,51.69 v31.42,51.68 | 32.64,53.85 R5.2
SDO  (via drill 0.35)
  Top 0.254: U2.14 27.15,30.28 26.87,30.55 v26.63,30.55
  Route2 0.406: v26.63,30.55 28.38,32.3 28.38,39.6 39.08,50.3 v39.08,53.98
  Bottom 0.406: R8.2 R7.2 v39.08,53.98 R6.2
SENSE_A
  Top 0.254: U2.20 28.4,27.88 28.32,27.88 27.35,26.9 27.11,26.9 26.95,26.74 26.95,25.31 28.14,24.12 28.14,21.19 28.62,20.71 33.75,20.71 R2.2 | U2.35 U2.EPAD10 | U2.36 U2.35 | U2.35 U2.34 | U2.40 U2.EPAD11 | U2.40 U2.39 | U2.41 U2.40
  Top 1.27: U2.35 33.07,22.15 33.78,21.45 R2.2 35.2,21.45 35.91,22.15 U2.40
SENSE_B
  Top 0.254: U2.9 28.48,32.28 28.3,32.46 28.3,38.57 29.25,39.52 34.04,39.52 34.04,38.71 | U2.EPAD13 U2.83 | U2.83 U2.84 | U2.82 U2.83 | U2.EPAD12 U2.78 | U2.78 U2.79 | U2.77 U2.78
  Top 1.27: U2.83 33.07,37.73 34.04,38.71 R1.2 34.93,38.71 35.91,37.73 U2.78
STBY/RESET
  Top 0.254: U2.19 28.09,28.28 27.25,27.44 26.08,27.44 | 25.45,27.44 26.08,27.44 | C6.1 26.1,27.41 26.08,27.44
  Top 0.305: U4.11 24.87,28.01 25.45,27.44
STCK  (via drill 0.35)
  Top 0.254: U2.17 27,29.08 26.25,28.32 25.76,28.32 | U4.12 24.92,28.65 25.25,28.32 25.76,28.32 | 25.76,28.32 25.93,28.15
  Top 0.406: 25.93,28.15 v26,28.15
  Bottom 0.406: v26,28.15 v25.99,28.15 25.99,27.7 26.85,26.85 R25.1
STOPPED  (via drill 0.35)
  Top 0.406: R9.2 10.92,18.43 v10.92,17.69
  Route2 0.406: v7.73,36.9 7.73,35.72 10.92,32.53 v10.92,17.69
  Bottom 0.254: U1.44 7.73,36.29 v7.73,36.9
SW  (via drill 0.35)
  Top 0.254: U2.18 27.53,28.68 v27.19,28.33
  Bottom 0.406: EMG_SW.1 28.54,21.82 27.9,22.46 27.9,27.62 v27.19,28.33
UART1_RX*
  Bottom 0.254: U1.43 6.17,37.15 P1.PAD_PD2
UART1_TX*  (via drill 0.35)
  Top 0.254: v6.93,35.46 5.24,37.15 P1.PAD_PU2
  Bottom 0.254: U1.42 7.15,35.46 v6.93,35.46
UART2_RX*
  Bottom 0.254: P1.PAD_PD3 16.88,15.72 9.81,22.8 9.81,23.11 U1.17
UART2_TX*  (via drill 0.35)
  Top 0.406: v15.76,17.94 15.76,17.29 P1.PAD_PU3
  Bottom 0.254: U1.16 13.29,22.95 13.29,20.08 15.44,17.94 v15.76,17.94
UART4_RX
  Bottom 0.254: U1.52 14.8,36.59 14.8,37.46 14.33,37.94 13.61,37.94 12.98,38.57 12.98,41.43 15.85,44.3 P1.PAD_PD8
UART4_TX  (via drill 0.35)
  Top 0.406: v14.09,37.14 14.09,38.15 13.46,38.79 13.46,41.23 16.52,44.3 P1.PAD_PU8
  Bottom 0.254: U1.51 14.09,36.59 v14.09,37.14
UART6_RX
  Bottom 0.254: U1.21 8,24.13 8,23.57 7.56,23.14 5.15,23.14 P1.PAD_PD1
UART6_TX  (via drill 0.35)
  Top 0.254: P1.PAD_PU1 5.35,22.46 v7.66,22.46
  Bottom 0.254: U1.20 8.45,23.88 8.45,23.25 v7.66,22.46
V_BOOT
  Top 0.254: U2.56 40.54,28.55 41.24,27.85 41.24,22.62 42.82,21.03 43.33,21.03 D1.2
  Top 0.406: D1.2 44.25,18.35 C3.1
VCCIO  (via drill 0.35)
  Top 0.254: U2.13 27.46,30.68 26.93,31.21 24,31.21 U4.16 | 24.75,27.38 25.15,26.98 25.15,24.2
  Top 0.406: R15.1 42.05,42.06 38.7,42.06 | 22.82,31.19 22.82,27.62 23.06,27.38 U4.10 | U3.16 23.14,38.49 22.82,38.17 22.82,34.44 | 38.7,42.06 26.47,42.06 25.62,41.21 C4.1 | 24.75,27.38 U4.10 | U4.10 | 25.15,24.2 R21.2 v24.99,23.09 R14.2 | U3.16 25.38,38.49 C16.1 C4.1 | U3.10 23.06,34.68 22.82,34.44 | 22.82,34.44 22.82,32.54 | 22.82,32.54 22.82,31.19 | U4.16 22.82,31.19 | C18.1 22.9,32.62 22.82,32.54 | C1.1 24.35,40.79 C4.1 | VCCIO.P$1 38.86,42.22 38.7,42.06 | U3.16 23.93,38.73 VCCIO1.P$1
  Bottom 0.406: R26.2 R13.2 v24.99,23.09 25.15,23.25 R25.2
VDD  (via drill 0.35)
  Top 0.406: C26.1 9.67,37.6 v9.65,37.62
  Bottom 0.254: U1.1 U1.64 19,32.3 C29.1 | U1.13 14.37,23.99 C25.1 | U1.48 9.65,37.21 v9.65,37.62 | C28.1 2.4,28.35 3.77,28.35 4.44,28.35 U1.32 | C27.1 8.89,21.92 8.89,23.6 U1.19
  Bottom 0.406: C25.1 15.55,21.03 C22.1 14.77,19.6 v14.73,19.6 | C27.1 8.43,21.14 | 8.43,21.14 7.69,20.4 C24.1 | 19,32.3 v19.17,32.3 | 3.77,28.35 3.76,28.35 v3.61,28.5 | 8.43,21.14 8.12,21.14 v8.12,21.38
  pour Top (isolate 0.305, no thermals): -0.04,30 8.53,15.08 20.12,15.08 20.12,45.08 8.53,45.08 -0.04,30.16
VSREG
  Top 0.254: R23.2 41.68,31.21 U2.61
  Top 0.356: 42.9,32.12 R23.2 | D10.2 44.23,33.45
  Top 0.406: 44.23,33.45 42.9,32.12 | D10.2 R24.2
VSS  (via drill 0.35)
  Top 0.254: 40.19,28.15 U2.55 39.15,28.15 v38.86,27.85 | 39.55,18.39 39.55,16.84 | 43.3,17.4 43.3,15.16 | U2.1 29.01,36.03 | U2.2 29.01,35.71 | U2.3 29.01,35.16 | U2.4 29.01,34.92 | U2.5 U2.6 | U2.89 30.04,37.05 | U2.88 30.44,37.05 | U2.87 U2.86 | U2.75 U2.74 | U2.74 38.93,37.05 | U2.73 U2.72 | U2.71 39.96,35.95 | U2.70 39.96,35.55 | U2.69 39.96,35.16 | U2.68 39.96,34.76 | U2.67 U2.66 | U2.52 39.96,25.31 | U2.51 39.96,24.92 | U2.50 39.96,24.52 | U2.49 U2.48 39.96,24.12 U2.47 39.96,23.65 | U2.46 38.93,23.1 | U2.45 U2.44 | U2.44 U2.43 | U2.32 30.44,23.1 | U2.31 29.97,23.1 | U2.30 U2.29 | U2.28 29.01,24.12 | U2.27 29.01,24.6 | U2.26 29.01,24.92 | U2.25 29.01,25.31 | U2.24 U2.23 | D10.1 44.25,30.28 v44.25,30.87
  Top 0.356: R23.1 42.81,30.2
  Top 0.406: 42.81,30.2 D10.1 | D1.1 42.35,18.35 C3.2 43.3,17.4 | 30.2,37.23 U2.88 | 30.44,23.1 29.97,23.1 U2.29 29.01,23.65 29.01,24.12 29.01,24.6 | 29.01,24.6 29.01,24.92 29.01,25.31 U2.23 29.68,25.76 v29.81,25.63 | 38.93,23.1 U2.44 U2.43 37.9,23.35 v37.9,23.73 | U2.46 39.96,23.65 39.96,24.12 39.96,24.52 | 39.96,25.31 39.96,24.92 39.96,24.52 | v31.08,23.73 31.08,23.35 U2.32 | v31.08,36.43 31.08,36.81 U2.86 30.44,37.05 30.04,37.05 | U2.89 29.01,36.51 U2.1 | 29.01,36.03 29.01,35.71 | 29.01,35.71 29.01,35.16 29.01,34.92 U2.6 29.52,34.4 v29.65,34.52 | 29.01,35.71 29.57,35.71 v29.65,35.79 30.28,35.16 v31.08,35.16 30.58,35.16 U2.EPAD1 | 29.01,24.6 29.25,24.36 v29.81,24.36 30.26,24.82 U2.EPAD2 30.9,24.82 v31.08,25 | v39.17,25.63 39.3,25.76 U2.52 | U2.EPAD5 38.39,25 v37.9,25 38.54,24.36 v39.17,24.36 39.81,24.36 39.96,24.52 | v37.9,36.43 37.9,36.81 U2.75 | U2.74 38.93,37.05 U2.72 39.96,36.51 U2.71 | 39.96,35.95 39.96,35.55 | 39.96,35.55 39.96,35.16 39.96,34.76 U2.66 39.3,34.4 v39.17,34.52 | v37.9,35.16 38.28,35.54 38.78,35.54 38.92,35.54 v39.17,35.79 39.73,35.79 39.96,35.55 | C13.1 38.86,21.66 39.97,20.55 39.97,18.81 39.55,18.39 | 38.62,15.63 R28.2 | 39.55,16.84 39.55,16.4 R28.2 | R28.2 38.59,15.45 39.75,14.28 42.43,14.28 43.3,15.16 | C14.1 37.03,52.7 v39.97,49.76 | v36.95,9.6 36.95,8.85 C15.1 31.79,7.3 VS.P$1
  Top 1.27: C10.1 30.2,24.62 | C12.1 30.2,37.23
  Top 1.422: C13.1 38.7,24.7 U2.EPAD5 | 30.2,24.62 U2.EPAD2 | U2.EPAD1 30.2,35.54 | C11.1 38.78,35.54 U2.EPAD6
  Route3 0.406: v39.97,49.76 39.97,46.75 39.81,46.59 | v36.95,9.6 36.95,11.98 37.11,12.14
  Bottom 0.406: v38.86,27.85 39.17,27.54 v39.17,25.63
  pour Bottom (isolate 0.457, no thermals): 37.9,23.09 37.58,23.41 37.58,27.22 39.33,28.97 39.33,32.46 37.58,34.2 37.58,36.59 38.06,37.06 39.97,37.06 41.55,35.48 55.52,35.48 55.52,24.36 41.39,24.36 40.12,23.09
  pour Route3 (isolate 0.914, no thermals): 26.47,48.81 43.62,48.81 52.19,40.24 52.19,19.12 44.09,11.03 26.47,11.03

## Text on the board
tPlace: B2 | 3V3 | P10 | B1 | P9* | - | 3V3 | P8 | + | P7 | isolation | 3V3 | A1 | A2
bPlace: GND | P10 | P9 | GND | isolation | P8 | GND | P7 | H17R10
bNames: B | C | D | R
Document: Total Thickness 1.6 mm / --------------------------------------------------------- / / copper_top_l1.gbr : Top Conductor - Copper: Thickness 0.035 mm / / Dielectric - FR-4: Thickness 0.175 mm / / copper_inner_l2.gbr : GND Plane - Copper: Thickness 0.035 mm / / Dielectric - FR-4: Thickness 1.11 mm / / copper_inner_l3.gbr : VDD Plane - Copper: Thickness 0.035 mm / / Dielectric - FR-4: Thickness 0.175 mm / / copper_bottom_l4.gbr : Bottom Conductor - Copper: Thickness 0.035 mm